# EAGLE design mono.stereo.mixer (EAGLE 9.6.2)
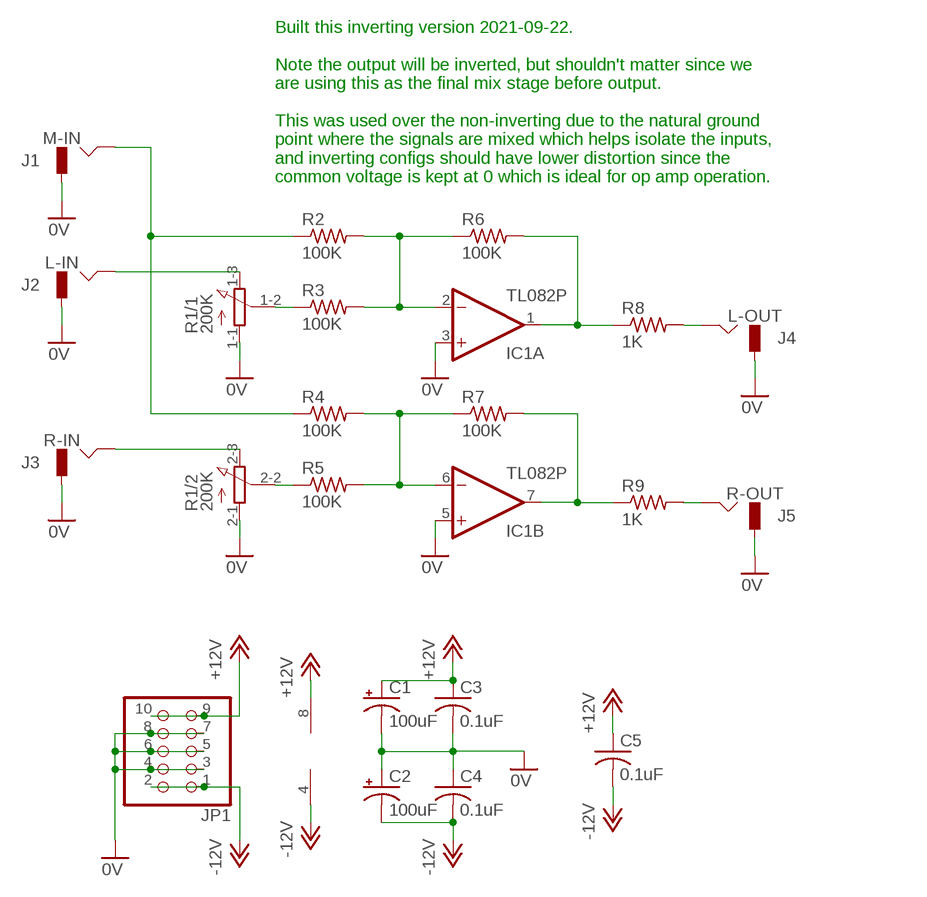
[diagram p0: schematic, sheet 1]

## Parts
C1  100uF  CPOL-USE2-5  [E2-5]
C2  100uF  CPOL-USE2-5  [E2-5]
C3  0.1uF  C-US025-024X044  [C025-024X044]
C4  0.1uF  C-US025-024X044  [C025-024X044]
C5  0.1uF  C-US025-024X044  [C025-024X044]
IC1  TL082P  [DIL08]
J1  M-IN  JACK-M  [JACK-M]
J2  L-IN  JACK-M  [JACK-M]
J3  R-IN  JACK-M  [JACK-M]
J4  L-OUT  JACK-M  [JACK-M]
J5  R-OUT  JACK-M  [JACK-M]
JP1  PINHD-2X5  [2X05]
R1  200K  3RP/1610G  [3RP/1610G]
R2  100K  R-US_0204/5  [0204/5]
R3  100K  R-US_0204/5  [0204/5]
R4  100K  R-US_0204/5  [0204/5]
R5  100K  R-US_0204/5  [0204/5]
R6  100K  R-US_0204/5  [0204/5]
R7  100K  R-US_0204/5  [0204/5]
R8  1K  R-US_0204/5  [0204/5]
R9  1K  R-US_0204/5  [0204/5]

## Nets
0V: C1.- C2.+ C3.2 C4.1 IC1.3(A:+IN) IC1.5(B:+IN) J1.GND J2.GND J3.GND J4.GND J5.GND JP1.3 JP1.4 JP1.5 JP1.6 JP1.7 JP1.8 R1.1-1(/1:A) R1.2-1(/2:A)
+12V: C1.+ C3.1 C5.1 IC1.8(P:V+) JP1.9 JP1.10
-12V: C2.- C4.2 C5.2 IC1.4(P:V-) JP1.1 JP1.2
N$4: J1.HOT R2.1 R4.1
N$5: IC1.2(A:-IN) R2.2 R3.2 R6.1
N$6: IC1.6(B:-IN) R4.2 R5.2 R7.1
N$7: IC1.1(A:OUT) R6.2 R8.1
N$8: J4.HOT R8.2
N$9: IC1.7(B:OUT) R7.2 R9.1
N$10: J5.HOT R9.2
N$11: J2.HOT R1.1-3(/1:E)
N$12: J3.HOT R1.2-3(/2:E)
N$13: R1.2-2(/2:S) R5.1
N$14: R1.1-2(/1:S) R3.1

## Notes on the sheet
- Built this inverting version 2021-09-22.
  
  Note the output will be inverted, but shouldn't matter since we 
  are using this as the final mix stage before output.
  
  This was used over the non-inverting due to the natural ground
  point where the signals are mixed which helps isolate the inputs,
  and inverting configs should have lower distortion since the
  common voltage is kept at 0 which is ideal for op amp operation.

## Library data of the parts
C1 C2 = rcl:CPOL-US: POLARIZED CAPACITOR, American symbol; SPICEPREFIX: C
C3-C5 = rcl:C-US: CAPACITOR, American symbol; SPICEPREFIX: C
IC1 = linear:TL082: OP AMP Data sheet <http://www.ti.com/lit/ds/symlink/tl084a . pdf>; DATA_SHEET: <a href="http://www.ti.com/lit/ds/symlink/tl084a.pdf"> Data sheet </a>
J1-J5 = _common:JACK-M
JP1 = pinhead:PINHD-2X5: PIN HEADER
R1 = _common:3RP/1610G: Generic two level pot.
R2-R9 = rcl:R-US_: RESISTOR, American symbol; SPICEPREFIX: R

## Board
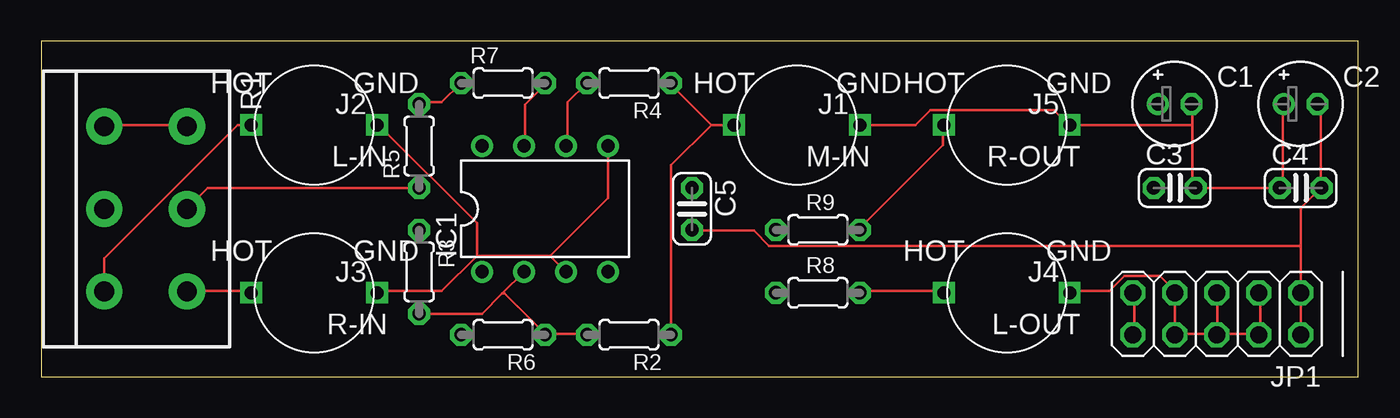
[diagram p1: board, top side]
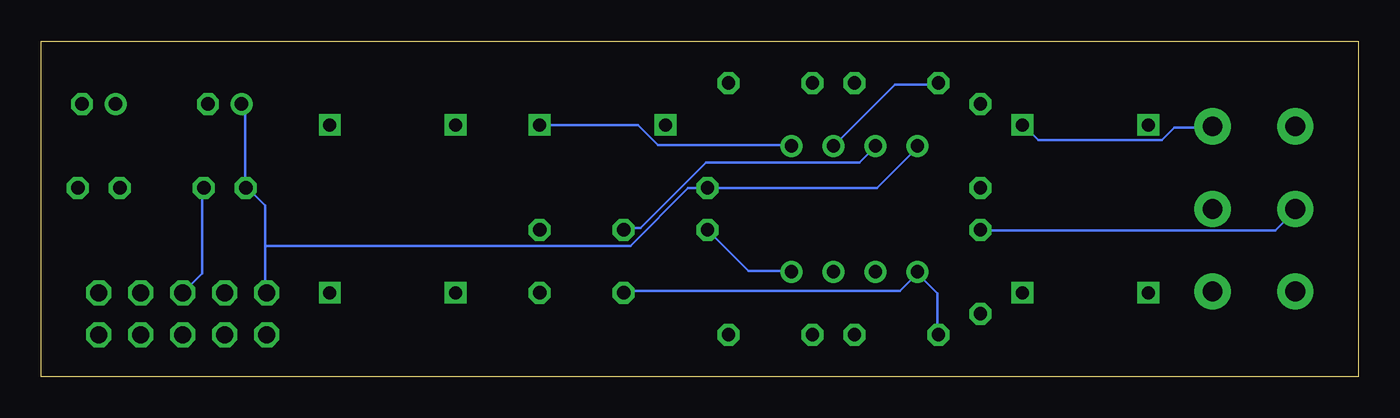
[diagram p2: board, bottom side, seen from below]

Size 79.68 x 20.31 mm. Coordinates in mm from the lower left corner, seen from the top.
Outline: 0,0 79.68,0 79.68,20.31 0,20.31 0,0
Copper layers (1*16): Top 0.035mm / dielectric 1.5mm / Bottom 0.035mm
Design rules "default": minimum track width 6mil, minimum drill 0.35mm, track to track 6mil, track to pad 6mil, pad to pad 6mil, via to via 6mil, smd to smd 6mil, copper to edge 40mil, drill to drill 6mil, minimum pad ring 10mil, minimum via ring 8mil, stop-mask expansion 4mil, vias tented up to drill 0mil, thermal gap 10mil

### Footprints (pad centres in the part's own frame; a part is rotated, then mirrored left to right if it is on the bottom)
E2-5 = drill 0.813 pad 1.27: + -1.016,0 | drill 0.813 pad 1.27 octagon: - 1.016,0
C025-024X044 = drill 0.813 octagon: 1 -1.27,0; 2 1.27,0
DIL08 = drill 0.813 pad 1.27: 1 -3.81,-3.81; 2 -1.27,-3.81; 3 1.27,-3.81; 4 3.81,-3.81; 5 3.81,3.81; 6 1.27,3.81; 7 -1.27,3.81; 8 -3.81,3.81
JACK-M = drill 0.8 square: GND -3.81,0; HOT 3.81,0
2X05 = drill 1.016 octagon: 1 -5.08,-1.27; 2 -5.08,1.27; 3 -2.54,-1.27; 4 -2.54,1.27; 5 0,-1.27; 6 0,1.27; 7 2.54,-1.27; 8 2.54,1.27; 9 5.08,-1.27; 10 5.08,1.27
3RP/1610G = drill 1.2 pad 2.184: 1-1 -5,0; 1-2 0,0; 1-3 5,0; 2-1 -5,5; 2-2 0,5; 2-3 5,5
0204/5 = drill 0.813 octagon: 1 -2.54,0; 2 2.54,0

### Placement (x,y rotation side)
C1  68.58,16.51 0 top
C2  76.2,16.51 0 top
C3  68.58,11.43 0 top
C4  76.2,11.43 0 top
C5  39.37,10.16 270 top
IC1  30.48,10.16 0 top
J1  45.72,15.24 180 top
J2  16.51,15.24 180 top
J3  16.51,5.08 180 top
J4  58.42,5.08 180 top
J5  58.42,15.24 180 top
JP1  71.12,3.81 180 top
R1  3.81,10.16 270 top
R2  35.56,2.54 180 top
R3  22.86,6.35 270 top
R4  35.56,17.78 180 top
R5  22.86,13.97 90 top
R6  27.94,2.54 180 top
R7  27.94,17.78 0 top
R8  46.99,5.08 0 top
R9  46.99,8.89 0 top

### Tracks (layer width: path | path; a pad name or v marks a point on that pad's centre or on a via)
0V
  Top 0.152: J1.GND 52.88,15.24 53.8,16.15 61.27,16.15 62.18,15.24 J5.GND 69.65,15.24 | 69.65,15.24 69.65,11.58 69.8,11.43 C3.2 C4.1 74.98,11.43 75.13,11.58 75.13,16.46 C2.+ | 69.65,15.24 69.65,16.46 C1.- | 71.17,2.59 71.17,5.03 JP1.5 | JP1.3 73.76,5.03 73.76,2.59 JP1.4 73.61,2.59 71.17,2.59 | 71.17,2.59 JP1.6 71.02,2.59 68.58,2.59 | J4.GND 62.33,5.18 64.62,5.18 65.53,6.1 67.67,6.1 68.58,5.18 JP1.7 68.58,2.59 | 68.58,2.59 JP1.8 | R1.1-1 3.81,15.24 8.69,15.24 R1.2-1 | 26.36,7.32 24.23,5.18 20.42,5.18 J3.GND | 30.79,7.32 26.36,7.32 | IC1.3 30.79,7.32 | 26.36,7.32 26.36,9.3 20.42,15.24 J2.GND | IC1.5 34.29,10.82 30.79,7.32
  Bottom 0.152: JP1.5 69.95,6.25 69.95,11.43 C3.2 | R1.2-1 8.84,15.09 11.12,15.09 11.89,14.33 19.36,14.33 20.27,15.24 J2.GND | J1.GND 43.59,15.24 42.37,14.02 34.29,14.02 IC1.5
+12V
  Top 0.152: JP1.10 66.14,2.59 66.14,5.03 JP1.9
  Bottom 0.152: IC1.8 26.67,13.87 29.11,11.43 C5.1 40.54,11.43 44.04,7.92 66.14,7.92 | C1.+ 67.36,16.31 67.36,11.43 C3.1 67.21,11.43 66.14,10.36 66.14,7.92 | 66.14,7.92 66.14,5.18 JP1.9
-12V
  Top 0.152: JP1.2 JP1.1 76.2,7.92 | 77.42,11.43 77.42,16.31 C2.- | 76.2,7.92 76.2,10.21 77.42,11.43 | 77.42,11.43 C4.2 | 76.2,7.92 44.04,7.92 43.13,8.84 39.47,8.84 C5.2
  Bottom 0.152: C5.2 36.88,6.4 34.29,6.4 IC1.4
N$4
  Top 0.152: 40.54,15.24 J1.HOT | 40.54,15.24 38.1,17.68 R4.1 | R2.1 38.1,12.8 40.54,15.24
N$5
  Top 0.152: 30.48,2.59 32.92,2.59 R2.2 | R3.2 26.67,3.81 27.89,5.03 | IC1.2 27.89,5.03 | 30.48,2.59 28.04,5.03 27.89,5.03 | 30.48,2.59 R6.1
N$6
  Top 0.152: R7.1 24.23,16.61 22.86,16.61 R5.2 | R4.2 31.85,16.61 31.85,14.02 IC1.6
  Bottom 0.152: IC1.6 28.04,17.68 25.45,17.68 R7.1
N$7
  Bottom 0.152: 26.67,6.25 25.45,5.03 25.45,2.59 R6.2 | 26.67,6.25 27.74,5.18 44.35,5.18 R8.1 | 26.67,6.25 IC1.1
N$8
  Top 0.152: J4.HOT 54.56,5.18 49.53,5.18 R8.2
N$9
  Top 0.152: IC1.7 29.26,14.02 29.26,16.46 30.48,17.68 R7.2
  Bottom 0.152: R9.1 44.35,8.99 43.43,8.99 39.47,12.95 30.18,12.95 29.26,13.87 IC1.7
N$10
  Top 0.152: J5.HOT 54.56,15.24 54.56,14.02 49.53,8.99 R9.2
N$11
  Top 0.152: J2.HOT 11.89,15.24 3.81,7.16 R1.1-3
N$12
  Top 0.152: J3.HOT 12.65,5.18 8.84,5.18 R1.2-3
N$13
  Top 0.152: R5.1 10.06,11.43 8.84,10.21 R1.2-2
N$14
  Bottom 0.152: R3.1 22.86,8.84 5.03,8.84 3.81,10.06 R1.1-2